# EAGLE design BaseMachine_Exio_Load_Save (EAGLE 7.2.0)
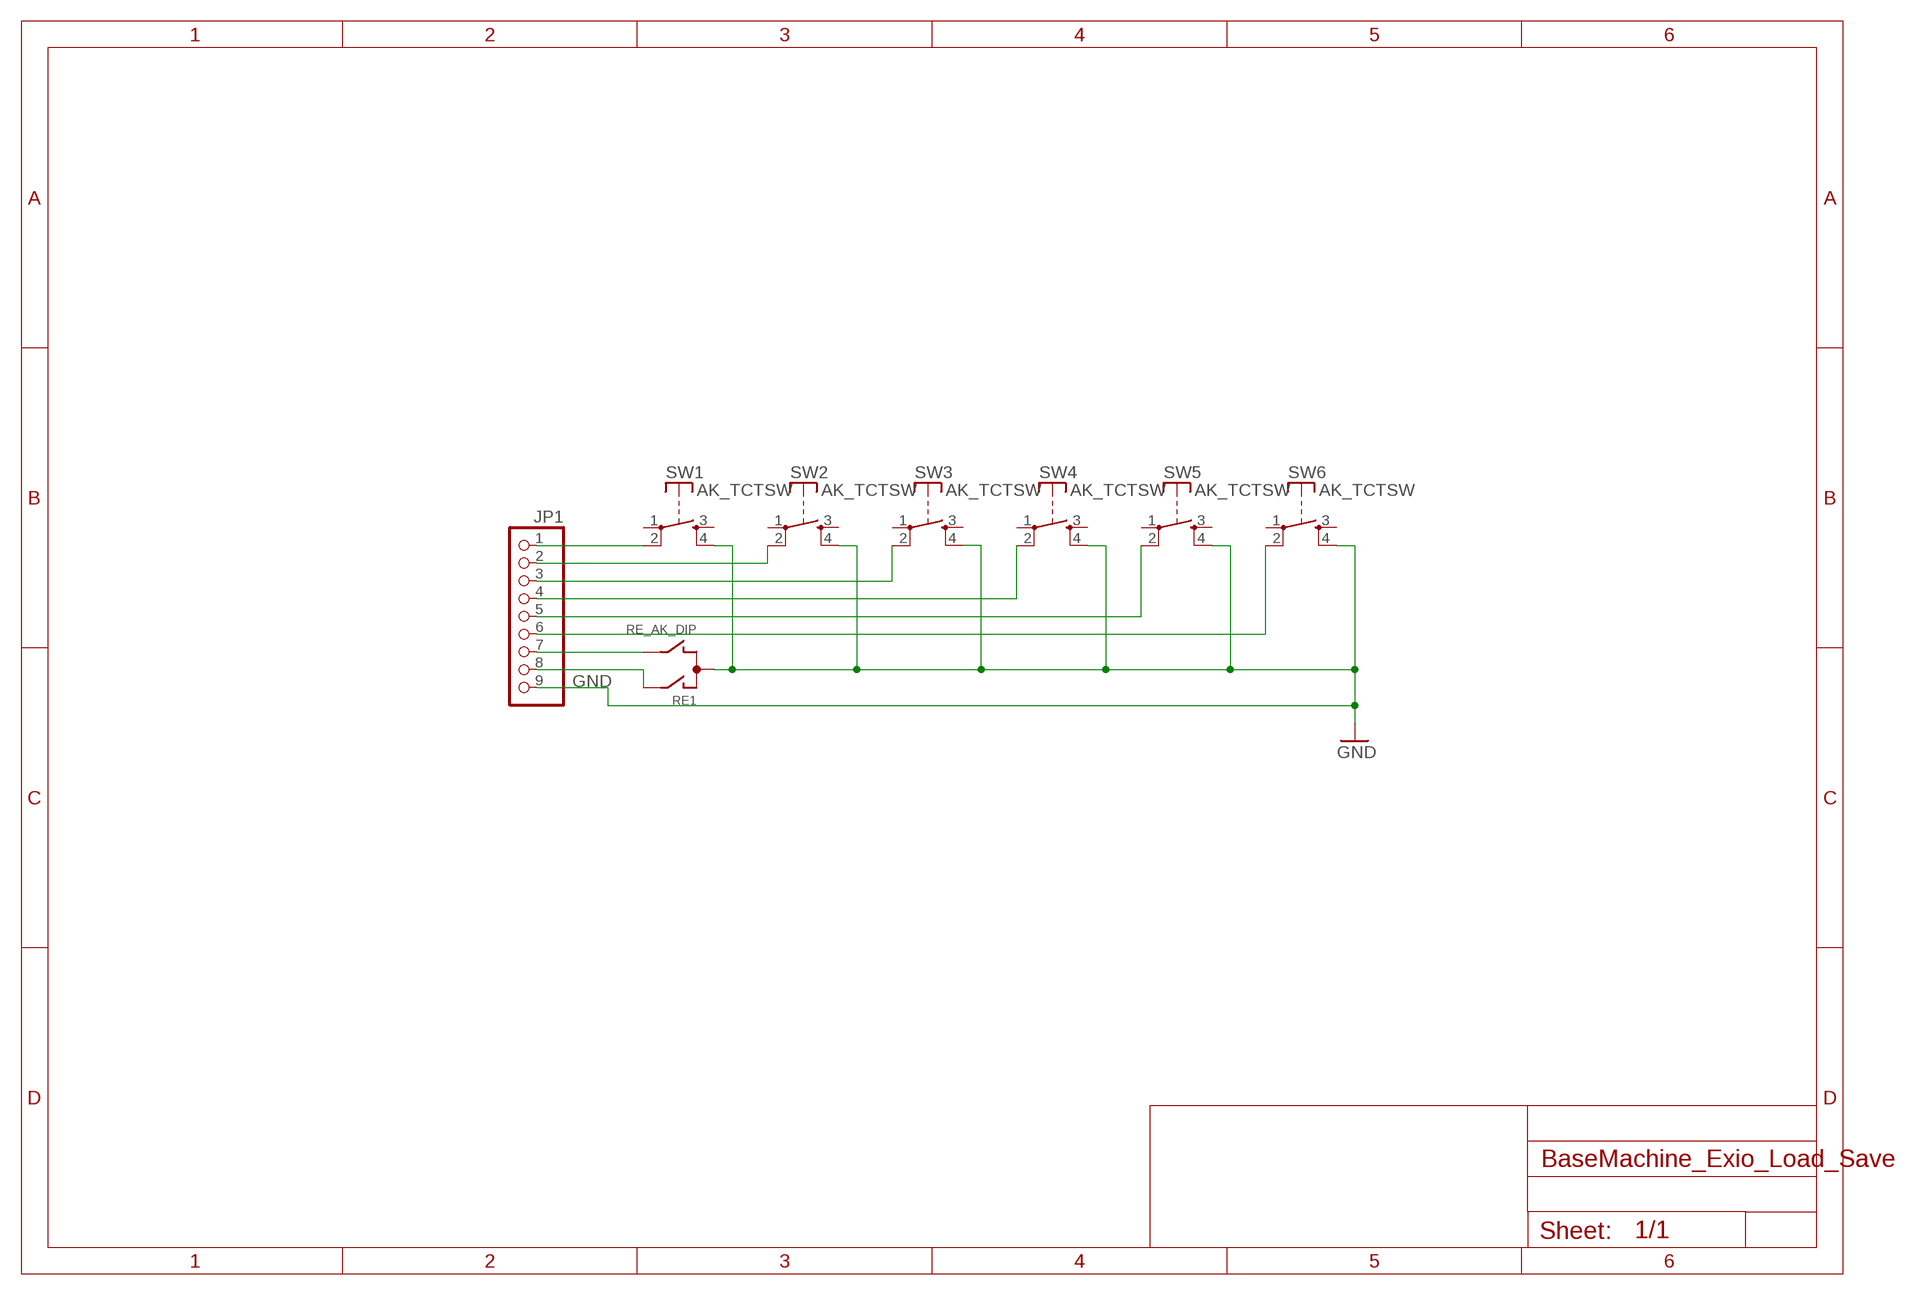
[diagram p0: schematic, sheet 1]

## Parts
JP1  PINHD-1X9  [1X09]
RE1  RE_AK_DIP  [RE_AK_DIP]
SW1  AK_TCTSW  [TME1]
SW2  AK_TCTSW  [TME1]
SW3  AK_TCTSW  [TME1]
SW4  AK_TCTSW  [TME1]
SW5  AK_TCTSW  [TME1]
SW6  AK_TCTSW  [TME1]

## Nets
GND: JP1.9 RE1.P$3(C) SW1.4(S) SW2.4(S) SW3.4(S) SW4.4(S) SW6.4(S)
N$1: JP1.1 SW1.2(P)
N$2: JP1.2 SW2.2(P)
N$3: JP1.3 SW3.2(P)
N$4: JP1.4 SW4.2(P)
N$5: JP1.5 SW5.2(P)
N$6: JP1.6 SW6.2(P)
N$7: JP1.7 RE1.P$4(B)
N$8: JP1.8 RE1.P$2(A)
N$9: SW5.4(S)
Unconnected: SW1.1(P) SW1.3(S) SW2.1(P) SW2.3(S) SW3.1(P) SW3.3(S) SW4.1(P) SW4.3(S) SW5.1(P) SW5.3(S) SW6.1(P) SW6.3(S)

## Library data of the parts
JP1 = pinhead:PINHD-1X9: PIN HEADER
RE1 = mylib2:RE_AK_DIP: 秋月 Rotary Encoder DIP化
SW1-SW6 = mylib2:AK_TCTSW

## Board
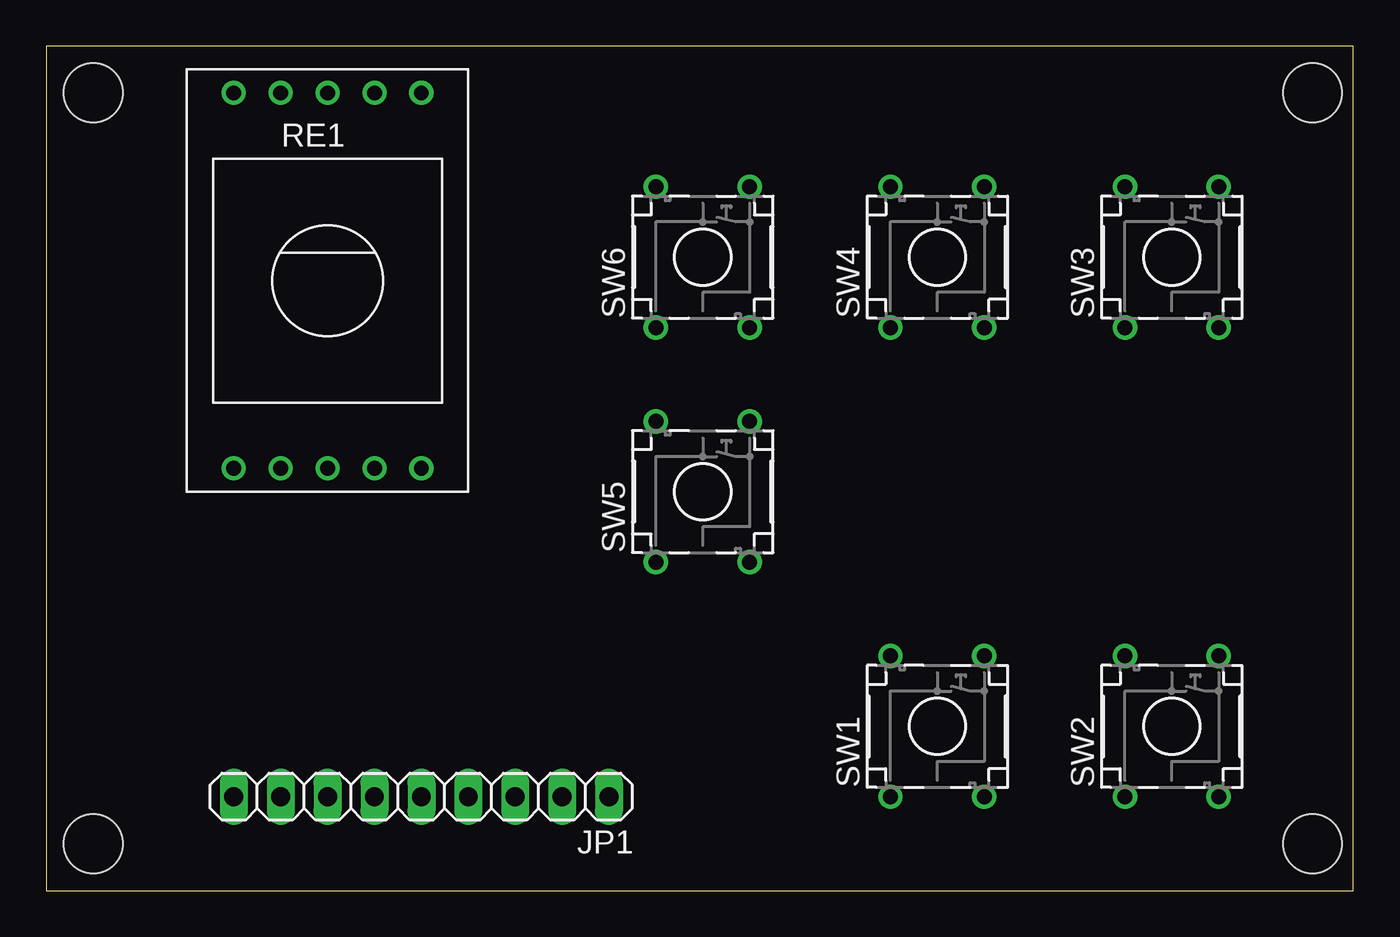
[diagram p1: board, top side]
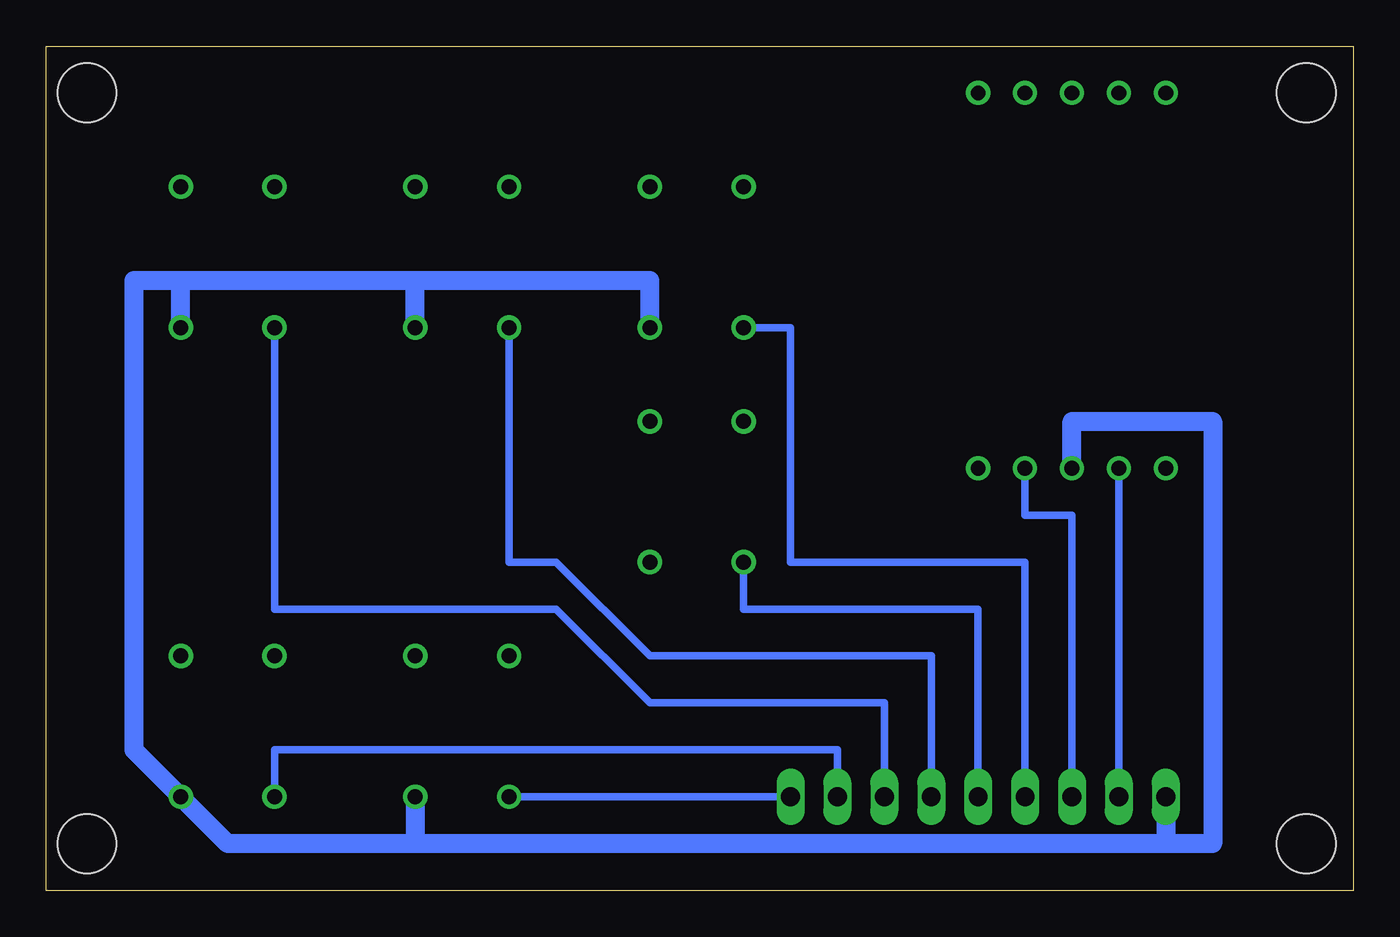
[diagram p2: board, bottom side, seen from below]

Size 70.79 x 45.71 mm. Coordinates in mm from the lower left corner, seen from the top.
Outline: 0,0 70.79,0 70.79,45.71 0,45.71 0,0
Copper layers (1*16): Top 0.035mm / dielectric 1.5mm / Bottom 0.035mm
Design rules "default": minimum track width 10mil, minimum drill 24mil, track to track 8mil, track to pad 8mil, pad to pad 8mil, via to via 8mil, smd to smd 8mil, copper to edge 40mil, drill to drill 8mil, minimum pad ring 10mil, minimum via ring 8mil, stop-mask expansion 4mil, vias tented up to drill 0mil, thermal gap 10mil
Holes 3.2 mm at 2.54,2.54 68.58,43.18 2.54,43.18 68.58,2.54

### Footprints (pad centres in the part's own frame; a part is rotated, then mirrored left to right if it is on the bottom)
1X09 = drill 1.016 long: 1 -10.16,0; 2 -7.62,0; 3 -5.08,0; 4 -2.54,0; 5 0,0; 6 2.54,0; 7 5.08,0; 8 7.62,0; 9 10.16,0
RE_AK_DIP = drill 0.8: P$1 -5.08,-10.16; P$2 -2.54,-10.16; P$3 0,-10.16; P$4 2.54,-10.16; P$5 5.08,-10.16; P$6 -5.08,10.16; P$7 -2.54,10.16; P$8 0,10.16; P$9 2.54,10.16; P$10 5.08,10.16
TME1 = drill 0.813: 1 -2.54,3.81; 2 -2.54,-3.81; 3 2.54,3.81; 4 2.54,-3.81

### Placement (x,y rotation side)
JP1  20.32,5.08 180 top
RE1  15.24,33.02 0 top
SW1  48.26,8.89 0 top
SW2  60.96,8.89 0 top
SW3  60.96,34.29 0 top
SW4  48.26,34.29 0 top
SW5  35.56,21.59 0 top
SW6  35.56,34.29 0 top

### Tracks (layer width: path | path; a pad name or v marks a point on that pad's centre or on a via)
GND
  Bottom 1.016: JP1.9 10.16,2.54 | 10.16,2.54 50.8,2.54 | 10.16,2.54 7.62,2.54 7.62,25.4 15.24,25.4 RE1.P$3 | SW1.4 50.8,2.54 | 50.8,2.54 60.96,2.54 SW2.4 66.04,7.62 66.04,33.02 63.5,33.02 | SW6.4 38.1,33.02 50.8,33.02 | 50.8,33.02 63.5,33.02 | SW4.4 50.8,33.02 | SW3.4 63.5,33.02
N$1
  Bottom 0.406: JP1.1 SW1.2
N$2
  Bottom 0.406: JP1.2 27.94,7.62 58.42,7.62 SW2.2
N$3
  Bottom 0.406: JP1.3 25.4,10.16 38.1,10.16 43.18,15.24 58.42,15.24 SW3.2
N$4
  Bottom 0.406: JP1.4 22.86,12.7 38.1,12.7 43.18,17.78 45.72,17.78 SW4.2
N$5
  Bottom 0.406: JP1.5 20.32,15.24 33.02,15.24 SW5.2
N$6
  Bottom 0.406: JP1.6 17.78,17.78 30.48,17.78 30.48,30.48 SW6.2
N$7
  Bottom 0.406: RE1.P$4 17.78,20.32 15.24,20.32 JP1.7
N$8
  Bottom 0.406: RE1.P$2 JP1.8